# Altium project Radio_DAC.PrjPcb
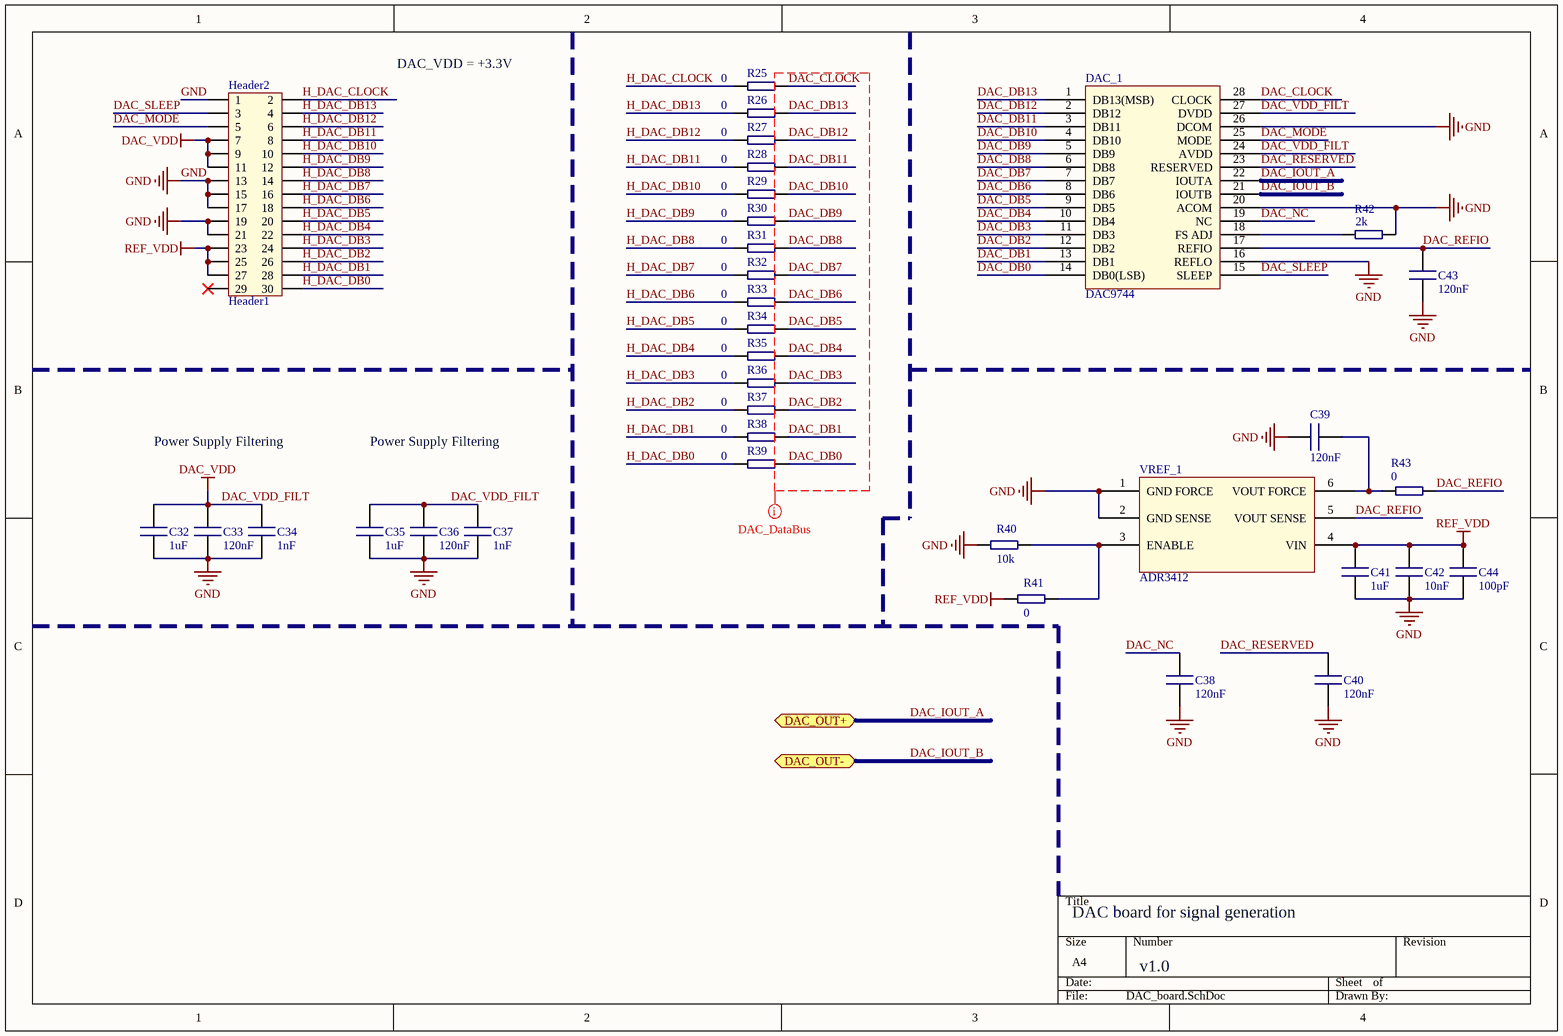
[diagram p0: DAC_board.SchDoc]
2 sheets, 69 parts. Net scope: flat (ports and power ports of the same name join across sheets).
Board file: DAC_Board.PcbDoc
Sheets:
  DAC_board.SchDoc
  DAC_Filter.SchDoc

## Sheet DAC_board.SchDoc
size A4; DocumentNumber: 2; SheetNumber: 2; SheetTotal: 9

### Parts
C32  value 1uF  [0805 SMD Passive]  (hidden comment: Cap1)
C33  value 120nF  [0805 SMD Passive]  (hidden comment: Cap1)
C34  value 1nF  [0805 SMD Passive]  (hidden comment: Cap1)
C35  value 1uF  [0805 SMD Passive]  (hidden comment: Cap1)
C36  value 120nF  [0805 SMD Passive]  (hidden comment: Cap1)
C37  value 1nF  [0805 SMD Passive]  (hidden comment: Cap1)
C38  value 120nF  [0805 SMD Passive]  (hidden comment: Cap1)
C39  value 120nF  [0805 SMD Passive]  (hidden comment: Cap1)
C40  value 120nF  [0805 SMD Passive]  (hidden comment: Cap1)
C41  value 1uF  [0805 SMD Passive]  (hidden comment: Cap1)
C42  value 10nF  [0805 SMD Passive]  (hidden comment: Cap1)
C43  value 120nF  [0805 SMD Passive]  (hidden comment: Cap1)
C44  value 100pF  [0805 SMD Passive]  (hidden comment: Cap1)
DAC_1  DAC9744  [AD9744]
Header2  Header1  [Header1]
R25  value 0  [0805 SMD Passive]  (hidden comment: Resistor)
R26  value 0  [0805 SMD Passive]  (hidden comment: Resistor)
R27  value 0  [0805 SMD Passive]  (hidden comment: Resistor)
R28  value 0  [0805 SMD Passive]  (hidden comment: Resistor)
R29  value 0  [0805 SMD Passive]  (hidden comment: Resistor)
R30  value 0  [0805 SMD Passive]  (hidden comment: Resistor)
R31  value 0  [0805 SMD Passive]  (hidden comment: Resistor)
R32  value 0  [0805 SMD Passive]  (hidden comment: Resistor)
R33  value 0  [0805 SMD Passive]  (hidden comment: Resistor)
R34  value 0  [0805 SMD Passive]  (hidden comment: Resistor)
R35  value 0  [0805 SMD Passive]  (hidden comment: Resistor)
R36  value 0  [0805 SMD Passive]  (hidden comment: Resistor)
R37  value 0  [0805 SMD Passive]  (hidden comment: Resistor)
R38  value 0  [0805 SMD Passive]  (hidden comment: Resistor)
R39  value 0  [0805 SMD Passive]  (hidden comment: Resistor)
R40  value 10k  [0805 SMD Passive]  (hidden comment: Resistor)
R41  value 0  [0805 SMD Passive]  (hidden comment: Resistor)
R42  value 2k  [0805 SMD Passive]  (hidden comment: Resistor)
R43  value 0  [0805 SMD Passive]  (hidden comment: Resistor)
VREF_1  ADR3412  [ADR3412]

### Ports
DAC_OUT+, DAC_OUT-

### Nets
DAC_VDD_FILT: C32.1 C33.1 C34.1 C35.1 C36.1 C37.1 DAC_1.24(AVDD) DAC_1.27(DVDD) Header2.7 Header2.9 Header2.11  [also labelled DAC_VDD]
GND: C32.2 C33.2 C34.2 C35.2 C36.2 C37.2 C38.2 C39.2 C40.2 C41.2 C42.2 C43.2 C44.2 DAC_1.16(REFLO) DAC_1.20(ACOM) DAC_1.26(DCOM) Header2.1 Header2.13 Header2.15 Header2.17 Header2.19 Header2.21 R40.2 R42.2 VREF_1.1(GND_FORCE) VREF_1.2(GND_SENSE)
REF_VDD: C41.1 C42.1 C44.1 Header2.23 Header2.25 Header2.27 R41.2 VREF_1.4(VIN)
DAC_CLOCK: DAC_1.28(CLOCK) R25.2
DAC_DB0: DAC_1.14(DB0(LSB)) R39.2
DAC_DB1: DAC_1.13(DB1) R38.2
DAC_DB2: DAC_1.12(DB2) R37.2
DAC_DB3: DAC_1.11(DB3) R36.2
DAC_DB4: DAC_1.10(DB4) R35.2
DAC_DB5: DAC_1.9(DB5) R34.2
DAC_DB6: DAC_1.8(DB6) R33.2
DAC_DB7: DAC_1.7(DB7) R32.2
DAC_DB8: DAC_1.6(DB8) R31.2
DAC_DB9: DAC_1.5(DB9) R30.2
DAC_DB10: DAC_1.4(DB10) R29.2
DAC_DB11: DAC_1.3(DB11) R28.2
DAC_DB12: DAC_1.2(DB12) R27.2
DAC_DB13: DAC_1.1(DB13(MSB)) R26.2
DAC_IOUT_A: DAC_1.22(IOUTA) ; port DAC_OUT+
DAC_IOUT_B: DAC_1.21(IOUTB) ; port DAC_OUT-
DAC_MODE: DAC_1.25(MODE) Header2.5
DAC_NC: C38.1 DAC_1.19(NC)
DAC_REFIO: C43.1 DAC_1.17(REFIO) R43.2 VREF_1.5(VOUT_SENSE)
DAC_RESERVED: C40.1 DAC_1.23(RESERVED)
DAC_SLEEP: DAC_1.15(SLEEP) Header2.3
H_DAC_CLOCK: Header2.2 R25.1
H_DAC_DB0: Header2.30 R39.1
H_DAC_DB1: Header2.28 R38.1
H_DAC_DB2: Header2.26 R37.1
H_DAC_DB3: Header2.24 R36.1
H_DAC_DB4: Header2.22 R35.1
H_DAC_DB5: Header2.20 R34.1
H_DAC_DB6: Header2.18 R33.1
H_DAC_DB7: Header2.16 R32.1
H_DAC_DB8: Header2.14 R31.1
H_DAC_DB9: Header2.12 R30.1
H_DAC_DB10: Header2.10 R29.1
H_DAC_DB11: Header2.8 R28.1
H_DAC_DB12: Header2.6 R27.1
H_DAC_DB13: Header2.4 R26.1
NetC39_1: C39.1 R43.1 VREF_1.6(VOUT_FORCE)
NetDAC_1_18: DAC_1.18(FS_ADJ) R42.1
NetR40_1: R40.1 R41.1 VREF_1.3(ENABLE)

Not connected (* = marked no-connect by the designer): Header2 29*

### Layout directives
net class DAC_DataBus: DAC_CLOCK, DAC_DB0, DAC_DB1, DAC_DB2, DAC_DB3, DAC_DB4, DAC_DB5, DAC_DB6, DAC_DB7, DAC_DB8, DAC_DB9, DAC_DB10, DAC_DB11, DAC_DB12, DAC_DB13

### Notes on the sheet
- DAC_VDD = +3.3V
- Power Supply Filtering
- DAC board for signal generation
- v1.0

### Library data of the parts
C32-C44 = Cap1: SMD Capacitor; Precision: 1%; MaxVolt: 16V; FootPrint: *
DAC_1 = AD9744: Digital Analog Converter; Manufacturer: Analog Devices; Order Code: AD9744ARZ; Package Description: 28-Lead TSSOP; PartNumber: AD9744
Header2 = Header1: 29 Pin Header; PartNumber: TLW-115-01-G-D-002-RA; Manufacterer: Samtec; PinNumber: 29; Row: 2; Pitch: 2.54mm; Type: 90°
R25-R43 = Res1: SMD Resistor; Precision: 1%; MaxPower: 0.1W; FootPrint: SMD
VREF_1 = ADR3412: 1.2 Voltage Ref Source; Manufacturer: Analog Devices; Order Code: ADR3412ARJZ-R2; Package Description: 6-Lead SOT-23; PartNumber: ADR3412

## Sheet DAC_Filter.SchDoc
size A4; DocumentNumber: 5; SheetNumber: 5; SheetTotal: 9
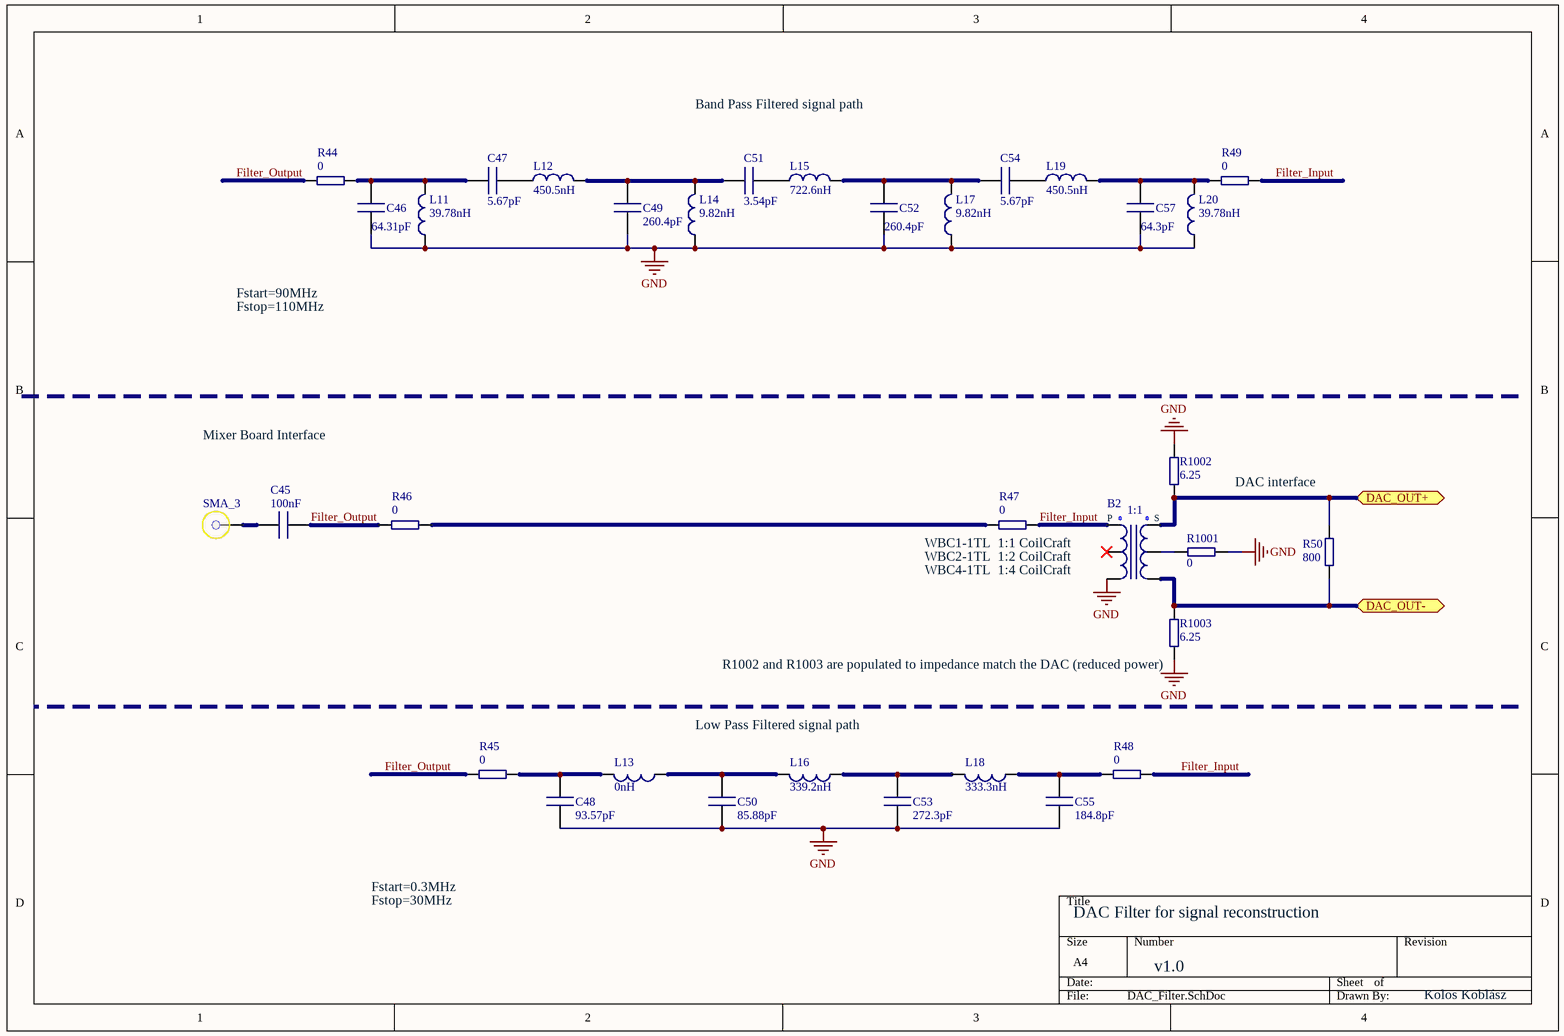
[diagram p1: DAC_Filter.SchDoc]

### Parts
B2  ImpedanceTransformation P : S: 1:1  [Balun_Coil_Craft_WBC]  (hidden comment: Balun)
C45  value 100nF  [0805 SMD Passive]  (hidden comment: Cap1)
C46  value 64.31pF  [0805 SMD Passive]  (hidden comment: Cap1)
C47  value 5.67pF  [0805 SMD Passive]  (hidden comment: Cap1)
C48  value 93.57pF  [0805 SMD Passive]  (hidden comment: Cap1)
C49  value 260.4pF  [0805 SMD Passive]  (hidden comment: Cap1)
C50  value 85.88pF  [0805 SMD Passive]  (hidden comment: Cap1)
C51  value 3.54pF  [0805 SMD Passive]  (hidden comment: Cap1)
C52  value 260.4pF  [0805 SMD Passive]  (hidden comment: Cap1)
C53  value 272.3pF  [0805 SMD Passive]  (hidden comment: Cap1)
C54  value 5.67pF  [0805 SMD Passive]  (hidden comment: Cap1)
C55  value 184.8pF  [0805 SMD Passive]  (hidden comment: Cap1)
C57  value 64.3pF  [0805 SMD Passive]  (hidden comment: Cap1)
L11  value 39.78nH  [0805 SMD Passive]  (hidden comment: Inductor)
L12  value 450.5nH  [0805 SMD Passive]  (hidden comment: Inductor)
L13  value 0nH  [0805 SMD Passive]  (hidden comment: Inductor)
L14  value 9.82nH  [0805 SMD Passive]  (hidden comment: Inductor)
L15  value 722.6nH  [0805 SMD Passive]  (hidden comment: Inductor)
L16  value 339.2nH  [0805 SMD Passive]  (hidden comment: Inductor)
L17  value 9.82nH  [0805 SMD Passive]  (hidden comment: Inductor)
L18  value 333.3nH  [0805 SMD Passive]  (hidden comment: Inductor)
L19  value 450.5nH  [0805 SMD Passive]  (hidden comment: Inductor)
L20  value 39.78nH  [0805 SMD Passive]  (hidden comment: Inductor)
R44  value 0  [0805 SMD Passive]  (hidden comment: Resistor)
R45  value 0  [0805 SMD Passive]  (hidden comment: Resistor)
R46  value 0  [0805 SMD Passive]  (hidden comment: Resistor)
R47  value 0  [0805 SMD Passive]  (hidden comment: Resistor)
R48  value 0  [0805 SMD Passive]  (hidden comment: Resistor)
R49  value 0  [0805 SMD Passive]  (hidden comment: Resistor)
R50  value 800  [0805 SMD Passive]  (hidden comment: Resistor)
R1001  value 0  [0805 SMD Passive]  (hidden comment: Resistor)
R1002  value 6.25  [0805 SMD Passive]  (hidden comment: Resistor)
R1003  value 6.25  [0805 SMD Passive]  (hidden comment: Resistor)
SMA_3  SMA1  [SMA Flange]  (value not drawn)

### Ports
DAC_OUT+, DAC_OUT-

### Nets
GND: B2.4 C46.2 C48.1 C49.2 C50.1 C52.2 C53.1 C55.1 C57.2 L11.1 L14.1 L17.1 L20.1 R1001.2 R1002.2 R1003.2
DAC_IOUT_A: B2.1 R50.2 R1002.1 ; port DAC_OUT+
DAC_IOUT_B: B2.3 R50.1 R1003.1 ; port DAC_OUT-
Filter_Input: B2.6 R47.1 R48.1 R49.1
Filter_Output: C45.1 R44.2 R45.2 R46.1
NetB2_2: B2.2 R1001.1
NetC45_2: C45.2 SMA_3.1
NetC46_1: C46.1 C47.1 L11.2 R44.1
NetC47_2: C47.2 L12.1
NetC48_2: C48.2 L13.2 R45.1
NetC49_1: C49.1 C51.1 L12.2 L14.2
NetC50_2: C50.2 L13.1 L16.2
NetC51_2: C51.2 L15.1
NetC52_1: C52.1 C54.1 L15.2 L17.2
NetC53_2: C53.2 L16.1 L18.2
NetC54_2: C54.2 L19.1
NetC55_2: C55.2 L18.1 R48.2
NetC57_1: C57.1 L19.2 L20.2 R49.2
NetR46_2: R46.2 R47.2

Not connected (* = marked no-connect by the designer): B2 5*

### Notes on the sheet
- Band Pass Filtered signal path
- Fstart=90MHz
- Fstop=110MHz
- Mixer Board Interface
- DAC interface
- (near R47) WBC1-1TL  1:1 CoilCraft
- WBC2-1TL  1:2 CoilCraft
- WBC4-1TL  1:4 CoilCraft
- (near R1003) R1002 and R1003 are populated to impedance match the DAC (reduced power)
- Low Pass Filtered signal path
- Fstart=0.3MHz
- Fstop=30MHz
- DAC Filter for signal reconstruction
- v1.0
- Kolos Koblász
- (in symbol Balun3) P; S

### Library data of the parts
B2 = Balun3: SMD Balun; Manufacturer: CoilCraft; PartNumber: WBC1-1TL; MaxFrequency: 700MHz; MinFrequency: 0.25MHz; FootPrint: SMD
C45-C55 C57 = Cap1: as C32 on sheet DAC_board; FootPrint: *
L11-L20 = Ind1: SMD Inductor; Precision: 10%; MaxCurent: 100mA; FootPrint: SMD
R44-R50 R1001-R1003 = Res1: as R25 on sheet DAC_board; FootPrint: SMD
SMA_3 = SMA1: SMA Female; Shape: Straight; Footprint: *; PartNumber: *; Manufacturer: *; OrderCode: *; Mounting: TroughHole

## Nets that join several sheets
GND: DAC_board (26 pins), DAC_Filter (16 pins)
DAC_IOUT_A: DAC_board (DAC_1.22), DAC_Filter (B2.1 R50.2 R1002.1)
DAC_IOUT_B: DAC_board (DAC_1.21), DAC_Filter (B2.3 R50.1 R1003.1)